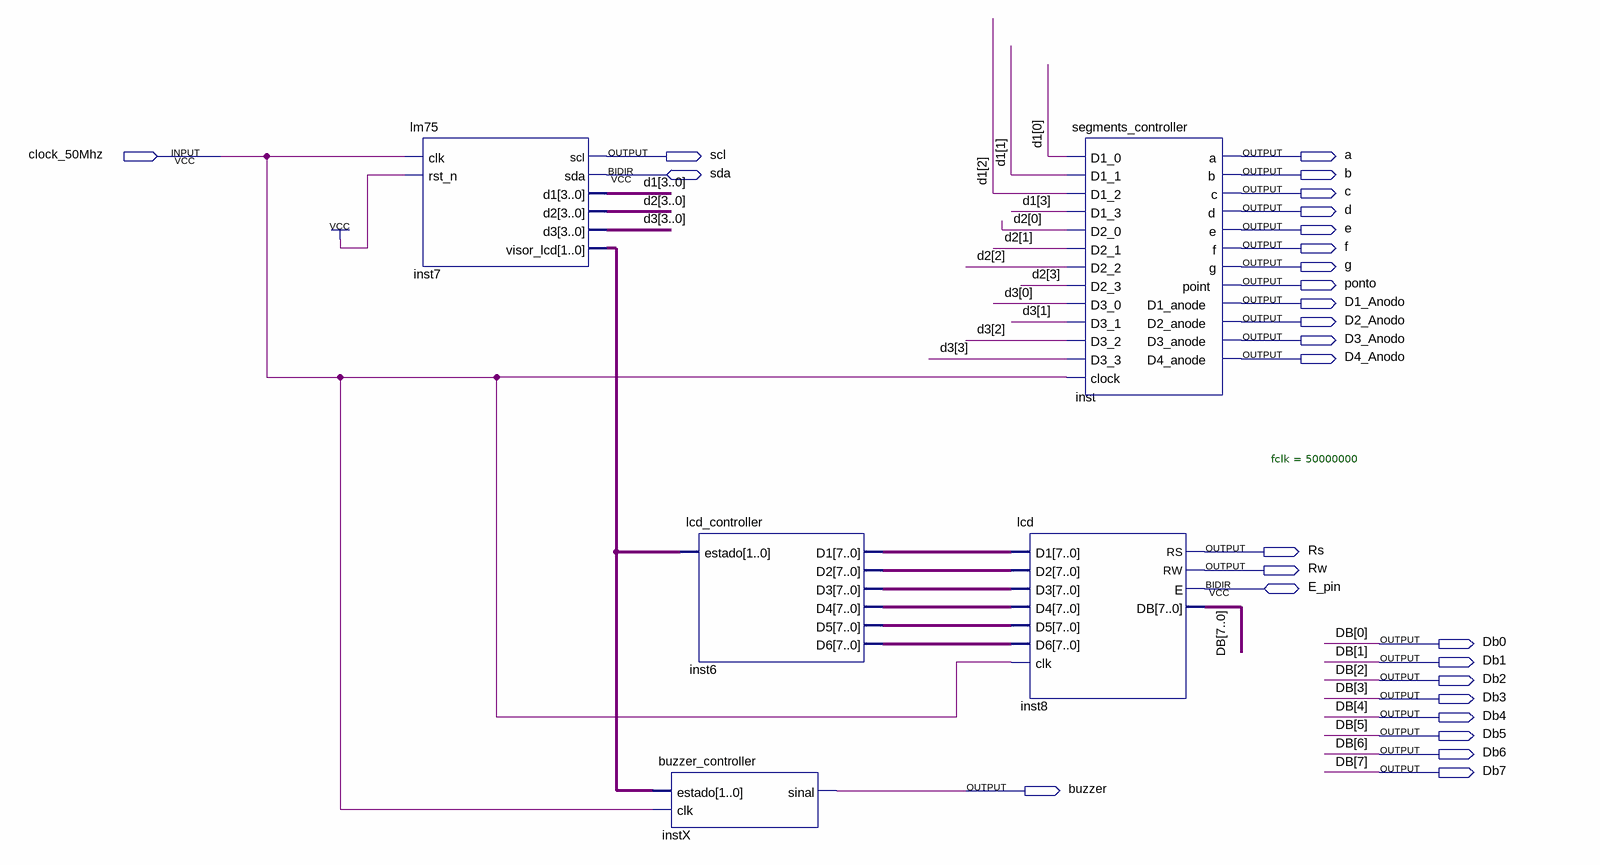
[diagram p0: schematic sheet]
// Quartus schematic test.bdf as structural Verilog: 5 symbols, 27 pins
module test (
  input  clock_50Mhz,
  inout  sda,
  inout  E_pin,
  output scl,
  output a,
  output b,
  output c,
  output d,
  output e,
  output f,
  output g,
  output ponto,
  output D1_Anodo,
  output D2_Anodo,
  output D3_Anodo,
  output D4_Anodo,
  output Rs,
  output Rw,
  output Db0,
  output Db1,
  output Db2,
  output Db3,
  output Db4,
  output Db5,
  output Db6,
  output Db7,
  output buzzer
);

  wire [1:0] inst7_visor_lcd;
  wire [3:0] d1, d2, d3;
  wire [7:0] inst6_d1, inst6_d2, inst6_d3, inst6_d4, inst6_d5, inst6_d6;

  lm75 inst7 (
    .clk(clock_50Mhz), .rst_n(1'b1), .scl(scl), .d1(d1), .d2(d2), .d3(d3), .visor_lcd(inst7_visor_lcd),
    .sda(sda));
  lcd_controller inst6 (
    .estado(inst7_visor_lcd), .D1(inst6_d1), .D2(inst6_d2), .D3(inst6_d3), .D4(inst6_d4), .D5(inst6_d5),
    .D6(inst6_d6));
  buzzer_controller instX (.estado(inst7_visor_lcd), .clk(clock_50Mhz), .sinal(buzzer));
  segments_controller inst (
    .D1_0(d1[0]), .D1_1(d1[1]), .D1_2(d1[2]), .D1_3(d1[3]), .D2_0(d2[0]), .D2_1(d2[1]), .D2_2(d2[2]),
    .D2_3(d2[3]), .D3_0(d3[0]), .D3_1(d3[1]), .D3_2(d3[2]), .D3_3(d3[3]), .clock(clock_50Mhz), .a(a), .b(b),
    .c(c), .d(d), .e(e), .f(f), .g(g), .point(ponto), .D1_anode(D1_Anodo), .D2_anode(D2_Anodo),
    .D3_anode(D3_Anodo), .D4_anode(D4_Anodo));
  lcd #(.fclk(50000000)) inst8 (
    .D1(inst6_d1), .D2(inst6_d2), .D3(inst6_d3), .D4(inst6_d4), .D5(inst6_d5), .D6(inst6_d6),
    .clk(clock_50Mhz), .RS(Rs), .RW(Rw), .E(E_pin), .DB({Db7, Db6, Db5, Db4, Db3, Db2, Db1, Db0}));
endmodule
